# EAGLE design FAIO_Multiplexer (EAGLE 9.6.2)
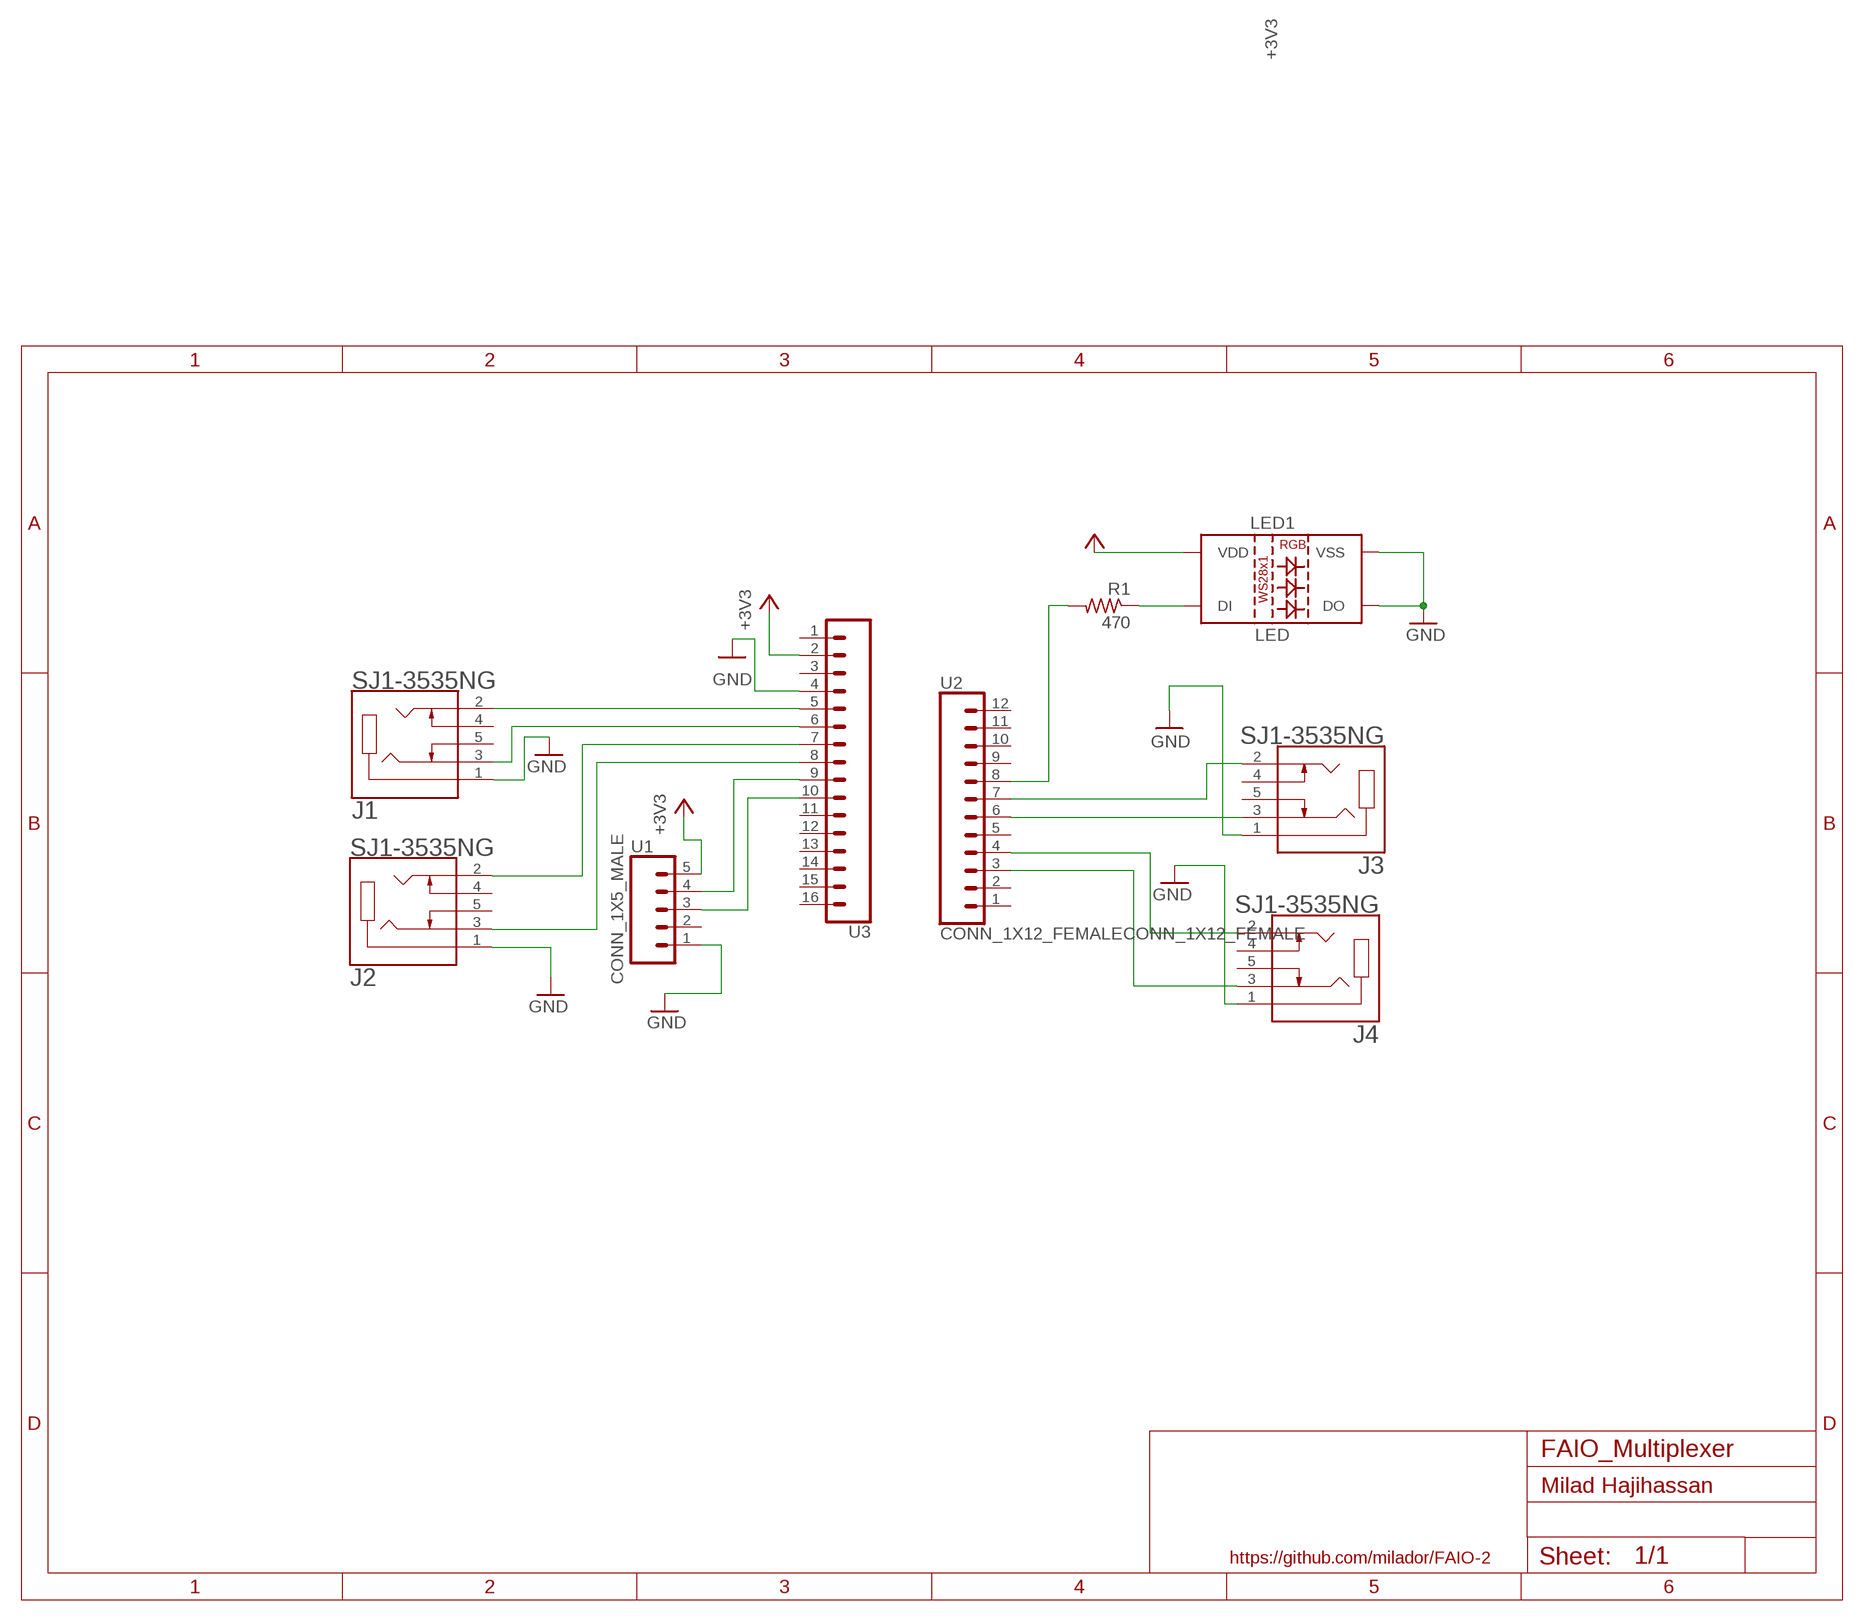
[diagram p0: schematic, sheet 1]

## Parts
J1  SJ1-3535NG  [CUI_SJ1-3535NG]
J2  SJ1-3535NG  [CUI_SJ1-3535NG]
J3  SJ1-3535NG  [CUI_SJ1-3535NG]
J4  SJ1-3535NG  [CUI_SJ1-3535NG]
LED1  LED  NEOPIXELS-5MM  [NEOPIXELS-5MM]
R1  470  R-US_0204/7  [0204/7]
U1  CONN_1X5_MALE  [CONN_1X5]
U2  CONN_1X12_FEMALECONN_1X12_FEMALE  [CONN_1X12]
U3  CONN_1X16_FEMALECONN_1X16_FEMALE  [CONN_1X16]

## Nets
+3V3: LED1.2(VDD) U1.5 U3.2
GND: J1.1 J2.1 J3.1 J4.1 LED1.3(VSS) LED1.4(DO) U1.1 U3.4
N$1: J3.3 U2.6
N$2: J3.2 U2.7
N$3: J4.2 U2.4
N$4: LED1.1(DI) R1.1
N$5: J4.3 U2.3
N$6: R1.2 U2.8
N$7: U1.4 U3.9
N$9: J1.2 U3.5
N$10: J1.3 U3.6
N$11: J2.2 U3.7
N$13: U1.3 U3.10
N$14: J2.3 U3.8
Unconnected: J1.4 J1.5 J2.4 J2.5 J3.4 J3.5 J4.4 J4.5 U1.2 U2.1 U2.2 U2.5 U2.9 U2.10 U2.11 U2.12 U3.1 U3.3 U3.11 U3.12 U3.13 U3.14 U3.15 U3.16

## Notes on the sheet
- Milad Hajihassan
- https://github.com/milador/FAIO-2

## Library data of the parts
J1-J4 = milador:SJ1-3535NG: SJ1 Series 3.5 mm 12 V Right Angle Through Hole Isolated Stereo Audio Jack; MANUFACTURER: CUI; PARTREV: 1.02; STANDARD: Manufacturer recommendation
LED1 = milador:NEOPIXELS-5MM: WS2812B PTH addressable RGB LED 5mm PTH LED with built-in controller IC. Color: Red/Green/Blue mC Rating: RGB: 390, 660, 180 mcd Forward Voltage: RGB: 2.0, 3.0, 3.0 V SparkFun Products: LED - RGB Addressable, PTH, 5mm Diffused (5 Pack) <https://www.sparkfun.com/products/12986> LED - RGB Addressable, PTH, 5mm Clear (5 Pack) <https://www.sparkfun.com/products/12999> Datasheet referenced for footprint: WS2812B-PTH <https://cdn.sparkfun.com/datasheets/Components/LED/COM-12877.pdf>
R1 = milador:R-US_0204/7
U1 = milador:CONN_1X5_MALE
U2 = milador:CONN_1X12_FEMALE
U3 = milador:CONN_1X16_FEMALE

## Board
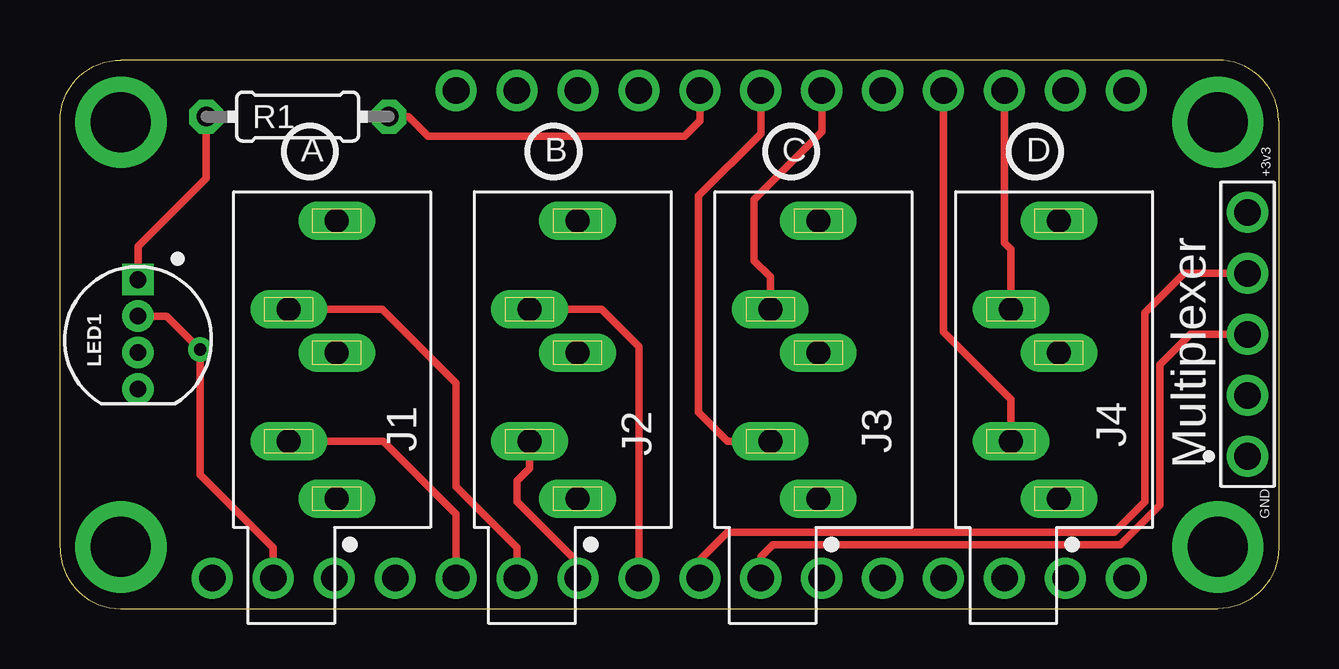
[diagram p1: board, top side]
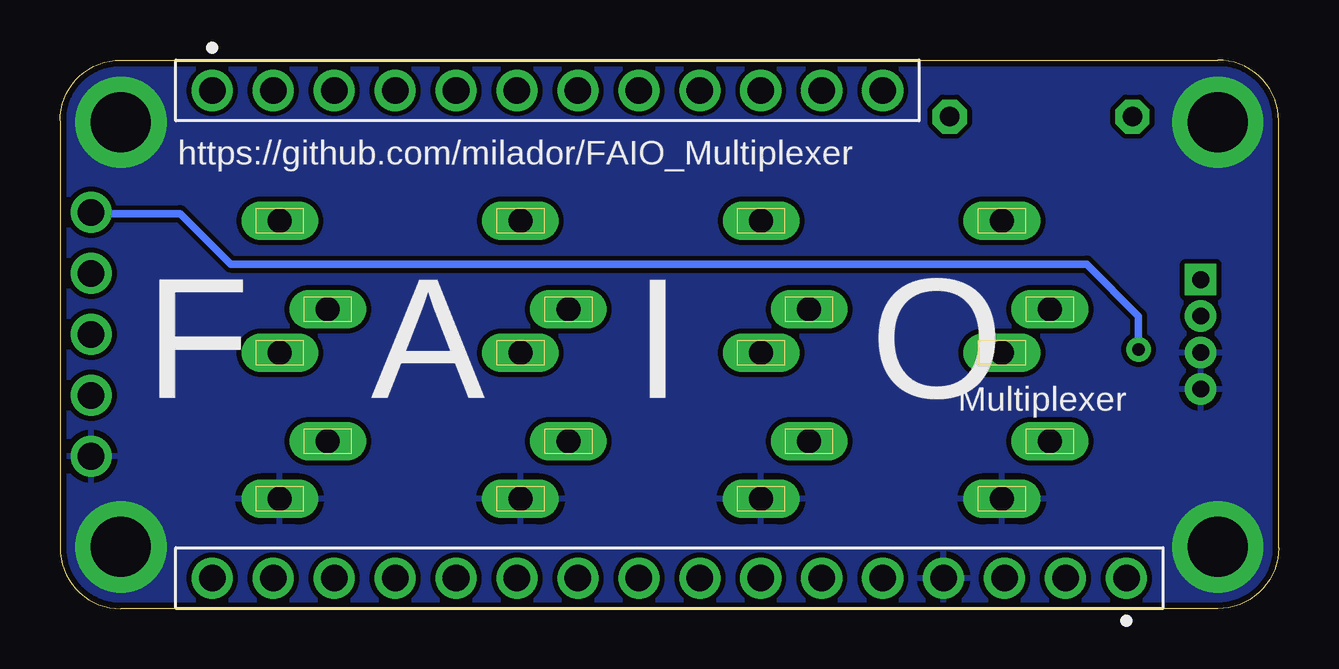
[diagram p2: board, bottom side, seen from below]

Size 50.8 x 22.86 mm. Coordinates in mm from the lower left corner, seen from the top.
Outline: 2.54,0 48.26,0 arc90 50.8,2.54 50.8,20.32 arc90 48.26,22.86 2.54,22.86 arc90 0,20.32 0,2.54 arc90 2.54,0
Copper layers (1*16): Top 0.035mm / dielectric 1.5mm / Bottom 0.035mm
Design rules "SparkFun": minimum track width 8mil, minimum drill 20mil, track to track 8mil, track to pad 8mil, pad to pad 8mil, via to via 8mil, smd to smd 8mil, copper to edge 10mil, drill to drill 8mil, minimum pad ring 12mil, minimum via ring 10mil, stop-mask expansion 4mil, vias tented up to drill 25mil, thermal gap 10mil

### Footprints (pad centres in the part's own frame; a part is rotated, then mirrored left to right if it is on the bottom)
CUI_SJ1-3535NG = drill 1 long: 1 0,0; 2 2.4,2; 3 7.9,2; 4 11.6,0; 5 6.1,0
NEOPIXELS-5MM = drill 0.7 pad 1.016 square: 1 2.28,0 | drill 0.7 pad 1.016: 2 0.76,0; 3 -0.76,0; 4 -2.28,0
0204/7 = drill 0.813 octagon: 1 -3.81,0; 2 3.81,0
CONN_1X5 = drill 1.105 pad 1.705: 1 0,0; 2 2.54,0; 3 5.08,0; 4 7.62,0; 5 10.16,0
CONN_1X12 = drill 1.105 pad 1.705: 1 0,0; 2 2.54,0; 3 5.08,0; 4 7.62,0; 5 10.16,0; 6 12.7,0; 7 15.24,0; 8 17.78,0; 9 20.32,0; 10 22.86,0; 11 25.4,0; 12 27.94,0
CONN_1X16 = drill 1.105 pad 1.705: 1 0,0; 2 2.54,0; 3 5.08,0; 4 7.62,0; 5 10.16,0; 6 12.7,0; 7 15.24,0; 8 17.78,0; 9 20.32,0; 10 22.86,0; 11 25.4,0; 12 27.94,0; 13 30.48,0; 14 33.02,0; 15 35.56,0; 16 38.1,0

### Placement (x,y rotation side)
J1  11.54,4.57 90 top
J2  21.57,4.57 90 top
J3  31.61,4.57 90 top
J4  41.64,4.57 90 top
LED1  3.25,11.43 90 top
R1  9.91,20.5 0 top
U1  49.5,6.35 90 top
U2  44.45,21.59 0 bottom
U3  6.35,1.27 180 bottom

### Tracks (layer width: path | path; a pad name or v marks a point on that pad's centre or on a via)
+3V3  (via drill 0.51)
  Top 0.305: U3.2 8.89,2.54 5.84,5.59 v5.84,10.79 4.45,12.19 LED1.2
  Bottom 0.203: U1.5 49.38,16.46
  Bottom 0.305: 49.38,16.46 45.8,16.46 43.69,14.35 8,14.35 5.84,12.19 v5.84,10.79
GND  (via drill 2.5 pad 3.81)
  other vias: 48.26,2.57 48.26,20.27 2.54,20.27 2.54,2.57
  pour Bottom: -0.25,23.11 -0.25,-0.25 51.05,-0.25 51.05,23.11
N$1
  Top 0.305: U2.6 31.75,19.86 28.93,17.04 28.93,14.5 29.61,13.83 J3.3
N$2
  Top 0.305: U2.7 29.21,19.79 26.62,17.2 26.62,8.18 27.83,6.97 J3.2
N$3
  Top 0.305: U2.4 36.83,11.53 39.64,8.72 J4.2
N$4
  Top 0.305: LED1.1 3.25,15.09 6.1,17.93 R1.1
N$5
  Top 0.305: J4.3 39.64,14.97 39.37,15.24 U2.3
N$6
  Top 0.305: U2.8 26.67,20.32 26.04,19.68 15.34,19.68 14.53,20.5 R1.2
N$7
  Top 0.305: U3.9 26.67,2.03 27.81,3.17 43.94,3.17 45.21,4.45 45.21,12.32 46.86,13.97 U1.4
N$9
  Top 0.305: U3.5 16.51,3.94 13.46,6.99 9.55,6.99 J1.2
N$10
  Top 0.305: J1.3 13.44,12.47 16.51,9.4 16.51,5.08 19.05,2.54 U3.6
N$11
  Top 0.305: J2.2 19.57,5.86 19.05,5.33 19.05,4.45 21.59,1.91 U3.7
N$13
  Top 0.305: U3.10 29.21,2.16 29.72,2.67 44.2,2.67 45.85,4.32 45.85,10.16 47.12,11.43 U1.3
N$14
  Top 0.305: J2.3 22.58,12.47 24.13,10.92 U3.8

### Text on the board
tPlace: +3v3 | GND
tNames: A | B | C | D | Multiplexer
bNames: https://github.com/milador/FAIO_Multiplexer | O | I | A | F | Multiplexer